# Altium project PROC154E3_SCH.PrjPcb (part 11 of 60)

## Sheet 18. SOC GENERAL.SchDoc: SOC - MAIN GENERAL
size 513 x 386 mm; Project: PROC154E2(001)_SK_AM69; Issue: 1.0; RevCode: E3; Page Create Date: March  8, 1995; Variant Name: Core Design; Schematic Page Number: 18; Page Number: 18; Page Size: C; Comment: MISTRAL_TITLEBLK_CSIZE_1; Page Count: 62; Schematic Page Count: 62; Name: PROC154E2 001 SK AM69; DsnPath: C:\Users\danie\Downloads\sprr466c\PROC154E3_RP\PROC154E3_SCH.DSN; SchematicName: SCHEMATIC1; PageName: 18. SOC GENERAL; PageSize: C; TopSchematic: True
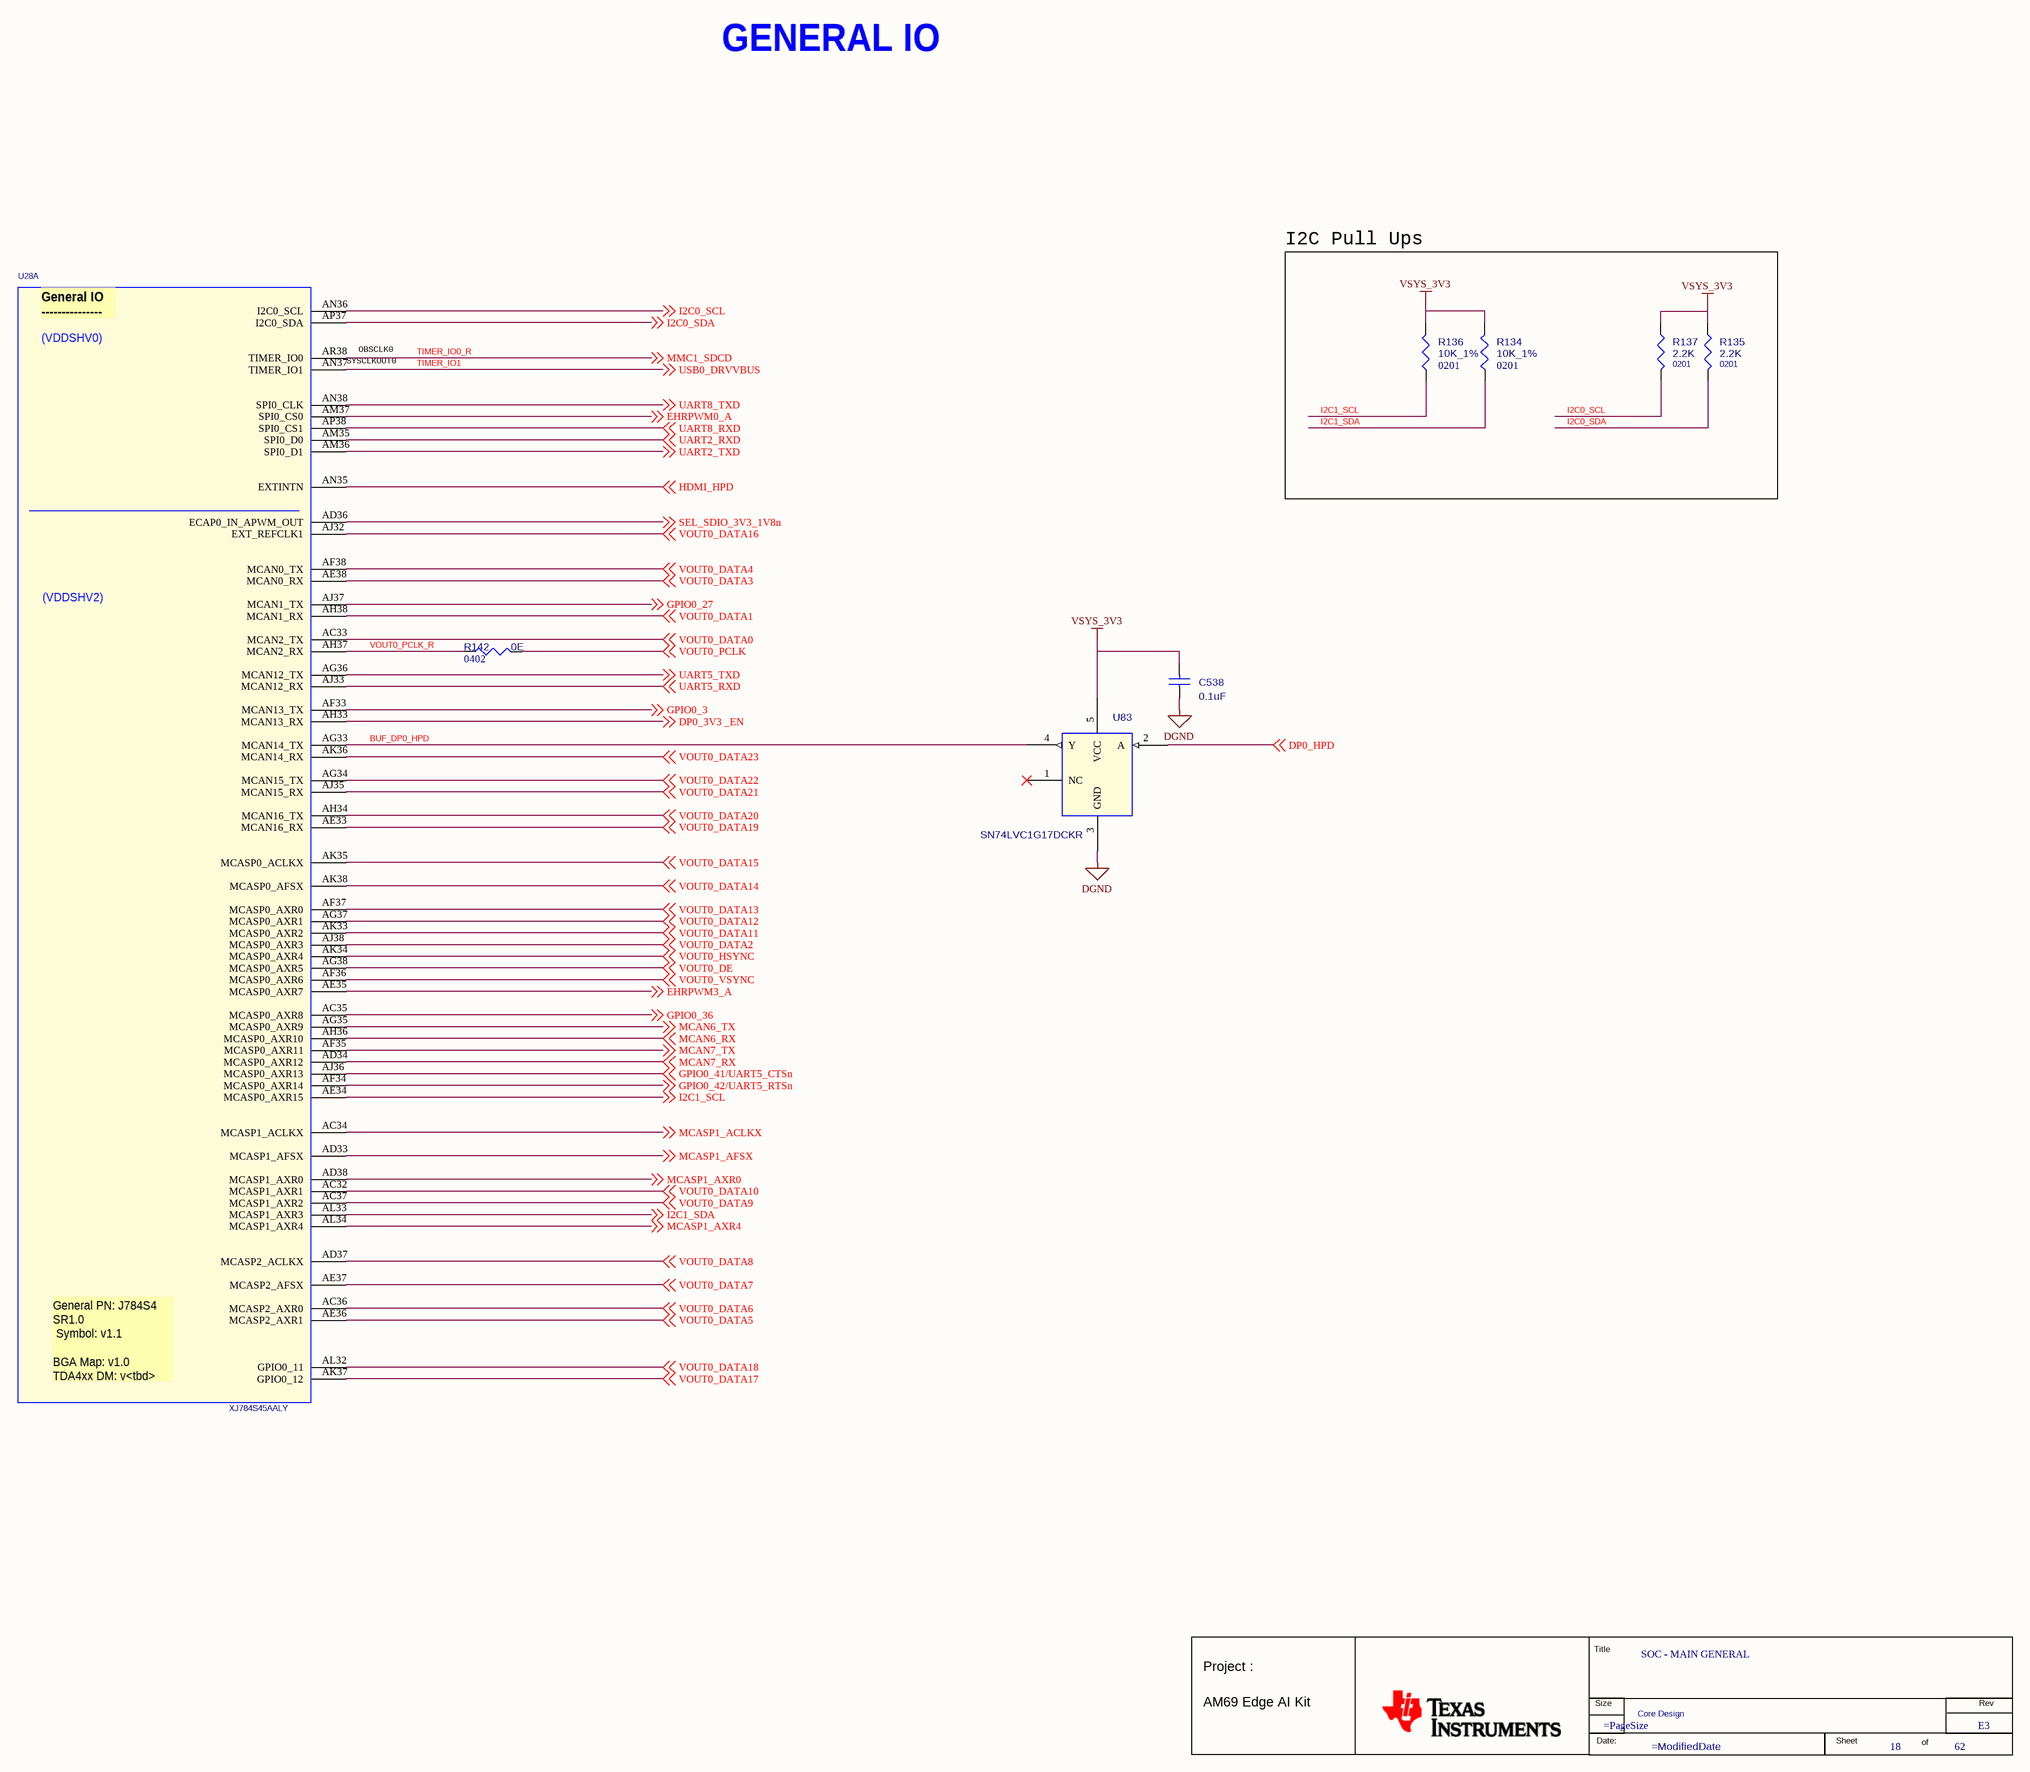
[diagram p26: 18. SOC GENERAL.SchDoc]

### Parts
(Parts that share a designator on the sheet are numbered #1, #2 ... from top to bottom, then left to right.)
*#18  RevCode: E3  Title: SOC - MAIN GENERAL  Page Number: 18  Page Count: 62  Variant Name: Core Design  (hidden comment: MISTRAL_TITLEBLK_CSIZE_1)  (graphical)
C538  0.1uF  [CAP0201_0-5]
R134  10K_1%  Package: 0201  [RES0201_0-5]
R135  2.2K  Package: 0201  [RES0201_0-5]
R136  10K_1%  Package: 0201  [RES0201_0-5]
R137  2.2K  Package: 0201  [RES0201_0-5]
R142  0E  Package: 0402  [RES0402_0-5]
U28  XJ784S45AALY  [BGA1414_31-49_1230X1230_2-7]  (part A of 26)
U83  SN74LVC1G17DCKR  [SC70-5]

### Blocks framed on the sheet
I2C Pull Ups: R134-R137

### Nets
DGND: C538.1 U83.3(GND)  [project net VDD_CPU_HCPS_GOSNS]
VSYS_3V3: C538.2 R134.2 R135.1 R136.2 R137.1 U83.5(VCC)  [project net V_3V3]
BUF_DP0_HPD: U28.AG33(MCAN14_TX) U83.4(Y)
DP0_3V3 _EN: U28.AH33(MCAN13_RX) ; off-sheet DP0_3V3 _EN
DP0_HPD: U83.2(A) ; off-sheet DP0_HPD
EHRPWM0_A: U28.AM37(SPI0_CS0) ; off-sheet EHRPWM0_A
EHRPWM3_A: U28.AE35(MCASP0_AXR7) ; off-sheet EHRPWM3_A
GPIO0_3: U28.AF33(MCAN13_TX) ; off-sheet GPIO0_3
GPIO0_27: U28.AJ37(MCAN1_TX) ; off-sheet GPIO0_27
GPIO0_36: U28.AC35(MCASP0_AXR8) ; off-sheet GPIO0_36
GPIO0_41/UART5_CTSn: U28.AJ36(MCASP0_AXR13) ; off-sheet GPIO0_41/UART5_CTSn
GPIO0_42/UART5_RTSn: U28.AF34(MCASP0_AXR14) ; off-sheet GPIO0_42/UART5_RTSn
HDMI_HPD: U28.AN35(EXTINTN) ; off-sheet HDMI_HPD
I2C0_SCL: R137.2 U28.AN36(I2C0_SCL) ; off-sheet I2C0_SCL
I2C0_SDA: R135.2 U28.AP37(I2C0_SDA) ; off-sheet I2C0_SDA
I2C1_SCL: R136.1 U28.AE34(MCASP0_AXR15) ; off-sheet I2C1_SCL
I2C1_SDA: R134.1 U28.AL33(MCASP1_AXR3) ; off-sheet I2C1_SDA
MCAN6_RX: U28.AH36(MCASP0_AXR10) ; off-sheet MCAN6_RX
MCAN6_TX: U28.AG35(MCASP0_AXR9) ; off-sheet MCAN6_TX
MCAN7_RX: U28.AD34(MCASP0_AXR12) ; off-sheet MCAN7_RX
MCAN7_TX: U28.AF35(MCASP0_AXR11) ; off-sheet MCAN7_TX
MCASP1_ACLKX: U28.AC34(MCASP1_ACLKX) ; off-sheet MCASP1_ACLKX
MCASP1_AFSX: U28.AD33(MCASP1_AFSX) ; off-sheet MCASP1_AFSX
MCASP1_AXR0: U28.AD38(MCASP1_AXR0) ; off-sheet MCASP1_AXR0
MCASP1_AXR4: U28.AL34(MCASP1_AXR4) ; off-sheet MCASP1_AXR4
SEL_SDIO_3V3_1V8n: U28.AD36(ECAP0_IN_APWM_OUT) ; off-sheet SEL_SDIO_3V3_1V8n
TIMER_IO0_R: U28.AR38(TIMER_IO0) ; off-sheet MMC1_SDCD  [also labelled MMC1_SDCD]
TIMER_IO1: U28.AN37(TIMER_IO1) ; off-sheet USB0_DRVVBUS  [also labelled USB0_DRVVBUS]
UART2_RXD: U28.AM35(SPI0_D0) ; off-sheet UART2_RXD
UART2_TXD: U28.AM36(SPI0_D1) ; off-sheet UART2_TXD
UART5_RXD: U28.AJ33(MCAN12_RX) ; off-sheet UART5_RXD
UART5_TXD: U28.AG36(MCAN12_TX) ; off-sheet UART5_TXD
UART8_RXD: U28.AP38(SPI0_CS1) ; off-sheet UART8_RXD
UART8_TXD: U28.AN38(SPI0_CLK) ; off-sheet UART8_TXD
VOUT0_DATA0: U28.AC33(MCAN2_TX) ; off-sheet VOUT0_DATA0
VOUT0_DATA1: U28.AH38(MCAN1_RX) ; off-sheet VOUT0_DATA1
VOUT0_DATA2: U28.AJ38(MCASP0_AXR3) ; off-sheet VOUT0_DATA2
VOUT0_DATA3: U28.AE38(MCAN0_RX) ; off-sheet VOUT0_DATA3
VOUT0_DATA4: U28.AF38(MCAN0_TX) ; off-sheet VOUT0_DATA4
VOUT0_DATA5: U28.AE36(MCASP2_AXR1) ; off-sheet VOUT0_DATA5
VOUT0_DATA6: U28.AC36(MCASP2_AXR0) ; off-sheet VOUT0_DATA6
VOUT0_DATA7: U28.AE37(MCASP2_AFSX) ; off-sheet VOUT0_DATA7
VOUT0_DATA8: U28.AD37(MCASP2_ACLKX) ; off-sheet VOUT0_DATA8
VOUT0_DATA9: U28.AC37(MCASP1_AXR2) ; off-sheet VOUT0_DATA9
VOUT0_DATA10: U28.AC32(MCASP1_AXR1) ; off-sheet VOUT0_DATA10
VOUT0_DATA11: U28.AK33(MCASP0_AXR2) ; off-sheet VOUT0_DATA11
VOUT0_DATA12: U28.AG37(MCASP0_AXR1) ; off-sheet VOUT0_DATA12
VOUT0_DATA13: U28.AF37(MCASP0_AXR0) ; off-sheet VOUT0_DATA13
VOUT0_DATA14: U28.AK38(MCASP0_AFSX) ; off-sheet VOUT0_DATA14
VOUT0_DATA15: U28.AK35(MCASP0_ACLKX) ; off-sheet VOUT0_DATA15
VOUT0_DATA16: U28.AJ32(EXT_REFCLK1) ; off-sheet VOUT0_DATA16
VOUT0_DATA17: U28.AK37(GPIO0_12) ; off-sheet VOUT0_DATA17
VOUT0_DATA18: U28.AL32(GPIO0_11) ; off-sheet VOUT0_DATA18
VOUT0_DATA19: U28.AE33(MCAN16_RX) ; off-sheet VOUT0_DATA19
VOUT0_DATA20: U28.AH34(MCAN16_TX) ; off-sheet VOUT0_DATA20
VOUT0_DATA21: U28.AJ35(MCAN15_RX) ; off-sheet VOUT0_DATA21
VOUT0_DATA22: U28.AG34(MCAN15_TX) ; off-sheet VOUT0_DATA22
VOUT0_DATA23: U28.AK36(MCAN14_RX) ; off-sheet VOUT0_DATA23
VOUT0_DE: U28.AG38(MCASP0_AXR5) ; off-sheet VOUT0_DE
VOUT0_HSYNC: U28.AK34(MCASP0_AXR4) ; off-sheet VOUT0_HSYNC
VOUT0_PCLK: R142.2 ; off-sheet VOUT0_PCLK
VOUT0_PCLK_R: R142.1 U28.AH37(MCAN2_RX)
VOUT0_VSYNC: U28.AF36(MCASP0_AXR6) ; off-sheet VOUT0_VSYNC

Not connected (* = marked no-connect by the designer): U83 1(NC)*

### Notes on the sheet
- GENERAL IO
- (near U28) SYSCLKOUT0
- OBSCLK0
- (in symbol J7AHPSoC-EVM_BGA1414, part A) General IO / ---------------; (VDDSHV0); (VDDSHV2); General PN: J784S4 / SR1.0 / Symbol: v1.1 / BGA Map: v1.0 / TDA4xx DM: v<tbd>
- (in symbol MISTRAL_TITLEBLK_CSIZE_1) Title; Project :; Size; Rev; AM69 Edge AI Kit; Date:; Sheet; of

### Library data of the parts
*#18 = MISTRAL_TITLEBLK_CSIZE_1: as *#16 on sheet 16. SOC MCU OSPI0 FLASH; Page Create Date: March  8, 1995; Page Size: =PageSize; Page Modify Date: =ModifiedDate; Schematic Page Count: 62; Schematic Page Number: 18
C538 = CAP_Dup1: CAP CERAMIC 0.1uF 16V 10% X7S AUTO 0201; Part Reference: C538; Part_type: CAPACITORS\CERAMIC; Mfr_part_number: GRT033C71C104KE01D; Mfr_name: MURATA; Mistral Part No: 120021030007-R; Custom_Duty: 15%; Customs_HS_Code: 85322990; Wattage: NA; Project: J7ES_SK_BRD; Value: 0.1uF; PCB Footprint: CAP0201_0-5; MECHANICAL 3D STEP FILE: CAP0201_0-5; Chkd/date: MANIRAJA/110321; Crtd /date: ALVY/110321; Datasheet: Y:\MIS_DATABASE\DATASHEETS\CAPACITORS\GRT033C71C104KE01.PDF; Temperature: -55°C+125°C; Weight: 330mg; Height: 0.33MM; Distributor_part_number: 490-GRT033C71C104KE01DTR-ND; Distributor_name: DIGIKEY; Package: 0201; Voltage: 16V; Tolerance: 10%
R134 = RESISTOR_Dup2: RES 10K 1/20W 1% 0201; Part Reference: R134; Part_type: RESISTORS\FIXED; Mfr_part_number: RC0603F103CS; Mfr_name: SAMSUNG; Mistral Part No: 110011040018-R; Custom_Duty: 15%; Customs_HS_Code: 85332119; Voltage: NA; Project: BRUKER_SD820_COMMONDO; Value: 10K_1%; PCB Footprint: RES0201_0-5; Footprint Path: Y:\MIS_DATABASE\Library\ALTIUM_TOOL\PCB_FOOTPRINTS\Altium_Footprint_Lib.PcbLib; Library Path: Y:\MIS_DATABASE\Library\ALTIUM_TOOL\SCHEMATICS_PARTS\MS_DISCRETE_Library.schlib; Footprint Ref: RES0201_0-5; Library Ref: RESISTOR; MECHANICAL 3D STEP FILE: RES0201_0-5; Chkd/date: MANIRAJA/080519; Crtd /date: ALVY/080519; Datasheet: Y:\MIS_DATABASE\DATASHEETS\RESISTORS\SAMSUNG_RC-SER.PDF; Temperature: -55°C+125°C; Weight: 0.15mg; Height: 0.26MM; Distributor_part_number: 1276-3670-1-ND; Distributor_name: DIGIKEY; Wattage: 1/20W; Tolerance: 1%; Manufacturer: SAMSUNG
R135 = RESISTOR_Dup2: RES 2.2K 1/20W 5% 0201; Part Reference: R135; Part_type: RESISTORS\FIXED; Mfr_part_number: RC0201JR-072K2L; Mfr_name: YAGEO AMERICA; Mistral Part No: 110009030427-R; Custom_Duty: 15%; Customs_HS_Code: 85332119; Voltage: NA; Project: GOLDEN-I LITE; Value: 2.2K; PCB Footprint: RES0201_0-5; MECHANICAL 3D STEP FILE: RES0201_0-5; Chkd/date: MANIRAJA/050517; Crtd /date: MANIRAJA/050517; Datasheet: Y:\MIS_DATABASE\DATASHEETS\RESISTORS\RCXXXXL-SER_MAR18.PDF; Temperature: -55°C+125°C; Weight: 0.17mg; Height: 0.26MM; Library Ref: RESISTOR; Distributor_part_number: 311-2.2KNCT-ND; Distributor_name: DIGIKEY; Wattage: 1/20W; Tolerance: 5%; Footprint Ref: RES0201_0-5; Library Path: Y:\MIS_DATABASE\Library\ALTIUM_TOOL\SCHEMATICS_PARTS\MS_DISCRETE_Library.schlib; Footprint Path: Y:\MIS_DATABASE\Library\ALTIUM_TOOL\PCB_FOOTPRINTS\Altium_Footprint_Lib.PcbLib; Manufacturer: YAGEO AMERICA
R136 = RESISTOR_Dup2: RES 10K 1/20W 1% 0201; Part Reference: R136; Mistral Part No: 110011040018-R; Mfr_name: SAMSUNG; Mfr_part_number: RC0603F103CS; Part_type: RESISTORS\FIXED; Project: BRUKER_SD820_COMMONDO; Voltage: NA; Customs_HS_Code: 85332119; Custom_Duty: 15%; Value: 10K_1%; PCB Footprint: RES0201_0-5; Tolerance: 1%; Wattage: 1/20W; Distributor_name: DIGIKEY; Distributor_part_number: 1276-3670-1-ND; Height: 0.26MM; Weight: 0.15mg; Temperature: -55°C+125°C; Datasheet: Y:\MIS_DATABASE\DATASHEETS\RESISTORS\SAMSUNG_RC-SER.PDF; Crtd /date: ALVY/080519; Chkd/date: MANIRAJA/080519; MECHANICAL 3D STEP FILE: RES0201_0-5; Library Ref: RESISTOR; Footprint Ref: RES0201_0-5; Library Path: Y:\MIS_DATABASE\Library\ALTIUM_TOOL\SCHEMATICS_PARTS\MS_DISCRETE_Library.schlib; Footprint Path: Y:\MIS_DATABASE\Library\ALTIUM_TOOL\PCB_FOOTPRINTS\Altium_Footprint_Lib.PcbLib; Manufacturer: SAMSUNG
R137 = RESISTOR_Dup2: RES 2.2K 1/20W 5% 0201; Part Reference: R137; Part_type: RESISTORS\FIXED; Mfr_part_number: RC0201JR-072K2L; Mfr_name: YAGEO AMERICA; Mistral Part No: 110009030427-R; Custom_Duty: 15%; Customs_HS_Code: 85332119; Voltage: NA; Project: GOLDEN-I LITE; Value: 2.2K; PCB Footprint: RES0201_0-5; MECHANICAL 3D STEP FILE: RES0201_0-5; Chkd/date: MANIRAJA/050517; Crtd /date: MANIRAJA/050517; Datasheet: Y:\MIS_DATABASE\DATASHEETS\RESISTORS\RCXXXXL-SER_MAR18.PDF; Temperature: -55°C+125°C; Weight: 0.17mg; Height: 0.26MM; Library Ref: RESISTOR; Distributor_part_number: 311-2.2KNCT-ND; Distributor_name: DIGIKEY; Wattage: 1/20W; Tolerance: 5%; Footprint Ref: RES0201_0-5; Library Path: Y:\MIS_DATABASE\Library\ALTIUM_TOOL\SCHEMATICS_PARTS\MS_DISCRETE_Library.schlib; Footprint Path: Y:\MIS_DATABASE\Library\ALTIUM_TOOL\PCB_FOOTPRINTS\Altium_Footprint_Lib.PcbLib; Manufacturer: YAGEO AMERICA
R142 = RESISTOR_Dup2: RES 0E 1/10W JUMPER 0402; Part Reference: R142; Manufacturer: PANASONIC-ECG; Mistral Part No: 110018030052-R; Mfr_part_number: ERJ-2GE0R00X; Part_type: RESISTORS\FIXED; IBISSP_MODLES: VALUE REPEATING 2 TIME; Project: AEGIS POM; Tolerance: NA; Customs_HS_Code: 85332119; Custom_Duty: 15%; SIGNAL_MODEL: RESISTOR_RES0402_0-5_0E_0E; Value: 0E; PCB Footprint: RES0402_0-5; Library Path: Y:\MIS_DATABASE\Library\ALTIUM_TOOL\SCHEMATICS_PARTS\MS_DISCRETE_Library.schlib; Footprint Ref: RES0402_0-5; Mfr_name: PANASONIC-ECG; Voltage: NA; Wattage: 1/10W; Distributor_name: DIGIKEY; Distributor_part_number: P0.0JCT-ND; Library Ref: RESISTOR; Height: 0.40MM; Weight: 0.8mg; Temperature: -55°C+155°C; Datasheet: Y:\MIS_DATABASE\DATASHEETS\RESISTORS\PAN-ERJSER_NOV17.PDF; Crtd /date: NAVEED/201014; Chkd/date: VASANTHA/061216; MECHANICAL 3D STEP FILE: RES0402_0-5; Footprint Path: Y:\MIS_DATABASE\Library\ALTIUM_TOOL\PCB_FOOTPRINTS\Altium_Footprint_Lib.PcbLib
U28 = J7AHPSoC-EVM_BGA1414: IC AM69 SoC EVM MICROPROCESSOR BGA1414; Part Reference: U28; Manufacturer: TEXAS INSTRUMENTS; Part_type: ICS\DIGITAL\MICROPROCESSOR; Mistral Part No: 141230020002; SPLIT_INST: TRUE; SWAP_INFO: (S1+S2+S3+S4+S5+S6+S7+S8+S9+S10+S11+S12+S13+S14+S15+S16+S17+S18+S19+S20+S21+S22+S23+S24+S25+S26); Custom_Duty: 15%; Customs_HS_Code: 85423100; Wattage: NA; Project: TI_J7AHP SK_BRD; Value: XJ784S45AALY; Footprint Path: Y:\MIS_DATABASE\Library\ALTIUM_TOOL\PCB_FOOTPRINTS\Altium_Footprint_Lib.PcbLib; Library Path: Y:\MIS_DATABASE\Library\ALTIUM_TOOL\SCHEMATICS_PARTS\MS_MICROPROCESSOR_Library.schlib; MECHANICAL 3D STEP FILE: BGA1414_31-49_1230X1230_2-7; RoHS: NA; Chkd/date: MANIRAJA/151221; Crtd /date: ALVY/141221; Datasheet: Y:\MIS_DATABASE\DATASHEETS\ICS\DIGITAL\MICROCONTROLLER\J7AHP-SoC-EVM.PDF; Temperature: NA; Weight: NA; Height: 2.70MM; Library Ref: J7AHPSoC-EVM_BGA1414; Distributor_part_number: NA; Distributor_name: NA; Package: BGA1414; Voltage: NA; Tolerance: NA; Mfr_part_number: XJ784S45AALY; Mfr_name: TEXAS INSTRUMENTS; Footprint Ref: BGA1414_31-49_1230X1230_2-7; PCB Footprint: BGA1414_31-49_1230X1230_2-7
U83 = SN74LVC1G17DCKR_SC70-5: IC SINGLE SCHMITT-TRIGGER BUFFER SC70-5; Part Reference: U83; Mistral Part No: 141010110012-R; Mfr_name: TEXAS INSTRUMENTS; Part_type: ICS\DIGITAL\COMBINATIONAL; Project: ITS-PWR_CARD; Tolerance: NA; Customs_HS_Code: 85423100; Custom_Duty: 15%; Value: SN74LVC1G17DCKR; PCB Footprint: SC70-5; Mfr_part_number: SN74LVC1G17DCKR; Voltage: NA; Wattage: NA; Package: SC70-5; Distributor_name: DIGIKEY; Distributor_part_number: 296-11934-1-ND; Library Ref: SN74LVC1G17DCKR_SC70-5; Height: 1.10MM; Weight: NA; Temperature: -40°C+85°C; Datasheet: Y:\MIS_DATABASE\DATASHEETS\ICS\DIGITAL\COMBINATIONAL\SN74LVC1G17DCK.PDF; Crtd /date: BAVISH/251110; Chkd/date: MAZHAR/011210